# Altium schematic sheet Vital_Sign_Logger_Connector.SchDoc
size A4; SheetNumber: 1; SheetTotal: 1
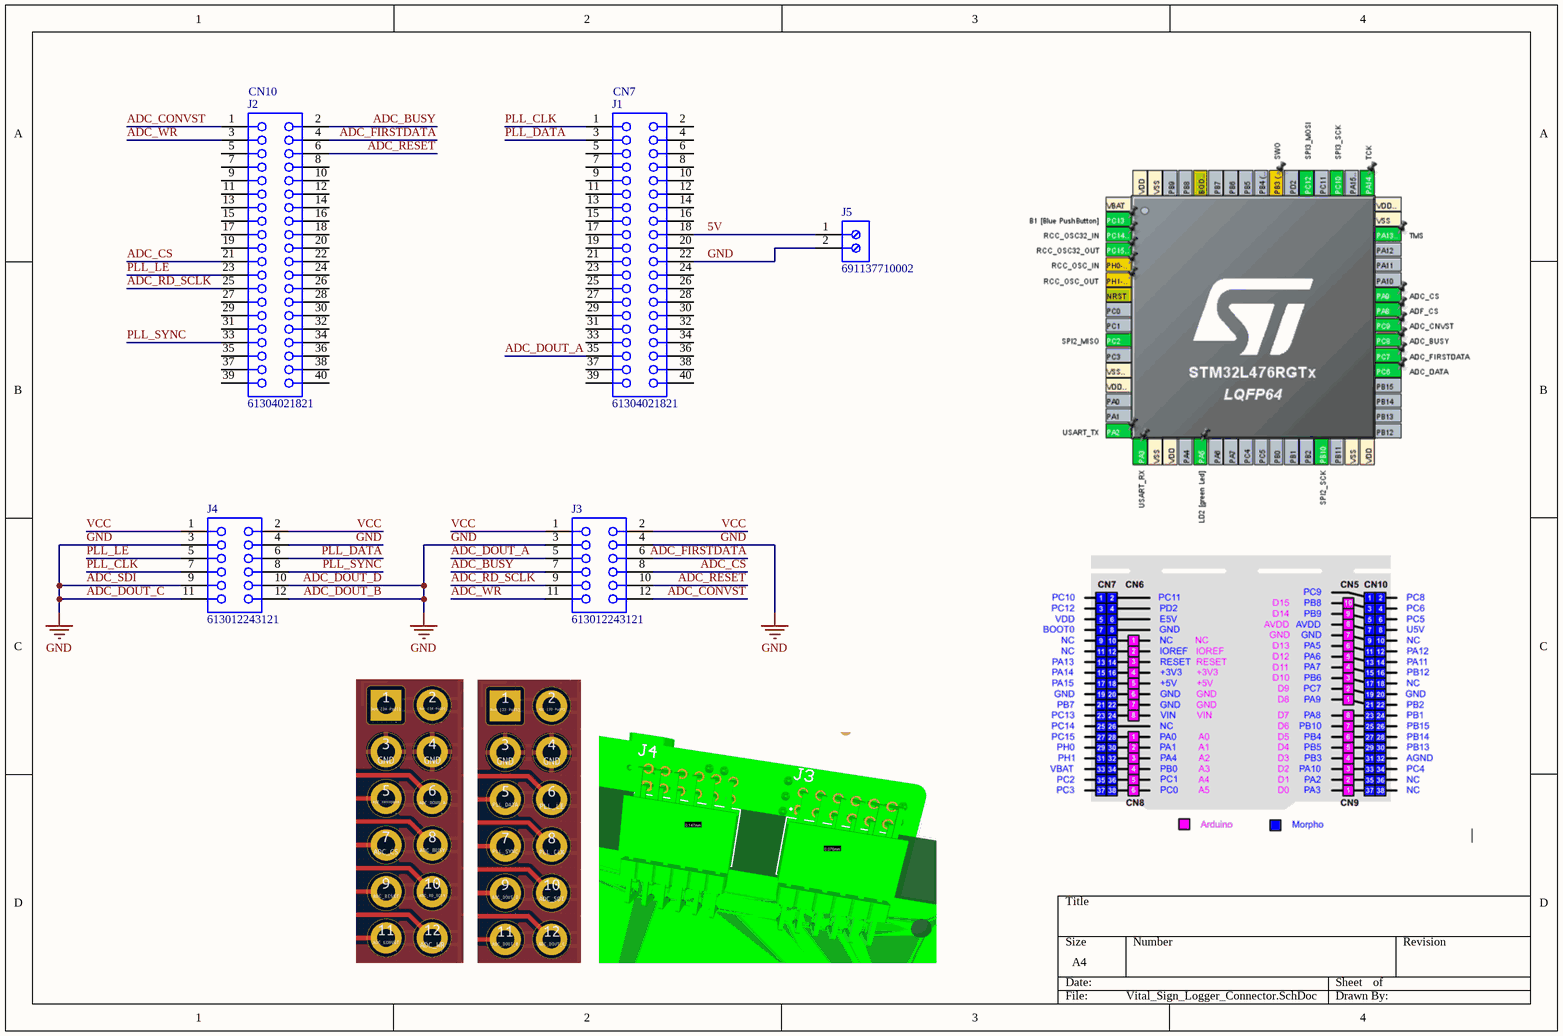
[diagram p0: Vital_Sign_Logger_Connector.SchDoc]

## Parts
J1  61304021821  [61304021821]
J2  61304021821  [61304021821]
J3  613012243121  [613012243121]
J4  613012243121  [613012243121]
J5  691137710002  [691137710002]

## Nets
ADC_DOUT_B: J1.22 J3.3 J3.4 J4.3 J4.4 J4.9 J4.10 J4.11 J4.12 J5.2  [also labelled ADC_DOUT_C, ADC_DOUT_D, ADC_SDI, GND]
5V: J1.18 J5.1
ADC_BUSY: J2.2 J3.7
ADC_CONVST: J2.1 J3.12
ADC_CS: J2.21 J3.8
ADC_DOUT_A: J1.35 J3.5
ADC_FIRSTDATA: J2.4 J3.6
ADC_RD_SCLK: J2.25 J3.9
ADC_RESET: J2.6 J3.10
ADC_WR: J2.3 J3.11
PLL_CLK: J1.1 J4.7
PLL_DATA: J1.3 J4.6
PLL_LE: J2.23 J4.5
PLL_SYNC: J2.33 J4.8
VCC: J3.1 J3.2 J4.1 J4.2

Not connected (* = marked no-connect by the designer): J1 2 4 5 6 7 8 9 10 11 12 13 14 15 16 17 19 20 21 23 24 25 26 27 28 29 30 31 32 33 34 36 37 38 39 40; J2 5 7 8 9 10 11 12 13 14 15 16 17 18 19 20 22 24 26 27 28 29 30 31 32 34 35 36 37 38 39 40

## Notes on the sheet
- (near J2) CN10
- (near J1) CN7

## Library data of the parts
J1 J2 = CMP-1502-01370-3: NexarPartId: 61924769; Gender: Female; Contact Resistance: 20mΩ; Current Rating: 3A; Operating Supply Voltage: 250V; Lead Pitch: 2.54mm; Number of Pins: 40; RoHS: Non-Compliant; Orientation: Vertical
J3 J4 = CMP-1502-01425-3: NexarPartId: 61924731; Contact Resistance: 20mΩ; Current Rating: 3A; Gender: Female; Operating Supply Voltage: 250V; RoHS: Non-Compliant; Number of Pins: 12; Lead Pitch: 2.54mm
J5 = CMP-1502-03324-2: NexarPartId: 78871135; Voltage Rating: 300V; Number of Contacts: 2; Current Rating: 16A; Lead Pitch: 5mm; Height: 11.6mm; Packaging: Box; RoHS: Non-Compliant; Contact Material: Nickel, Tin; Max Operating Temperature: 120°C; Number of Pins: 2; Min Operating Temperature: -30°C; Number of Rows: 1